# EAGLE design dual_encoder_shield_revC (EAGLE 8.6.0)
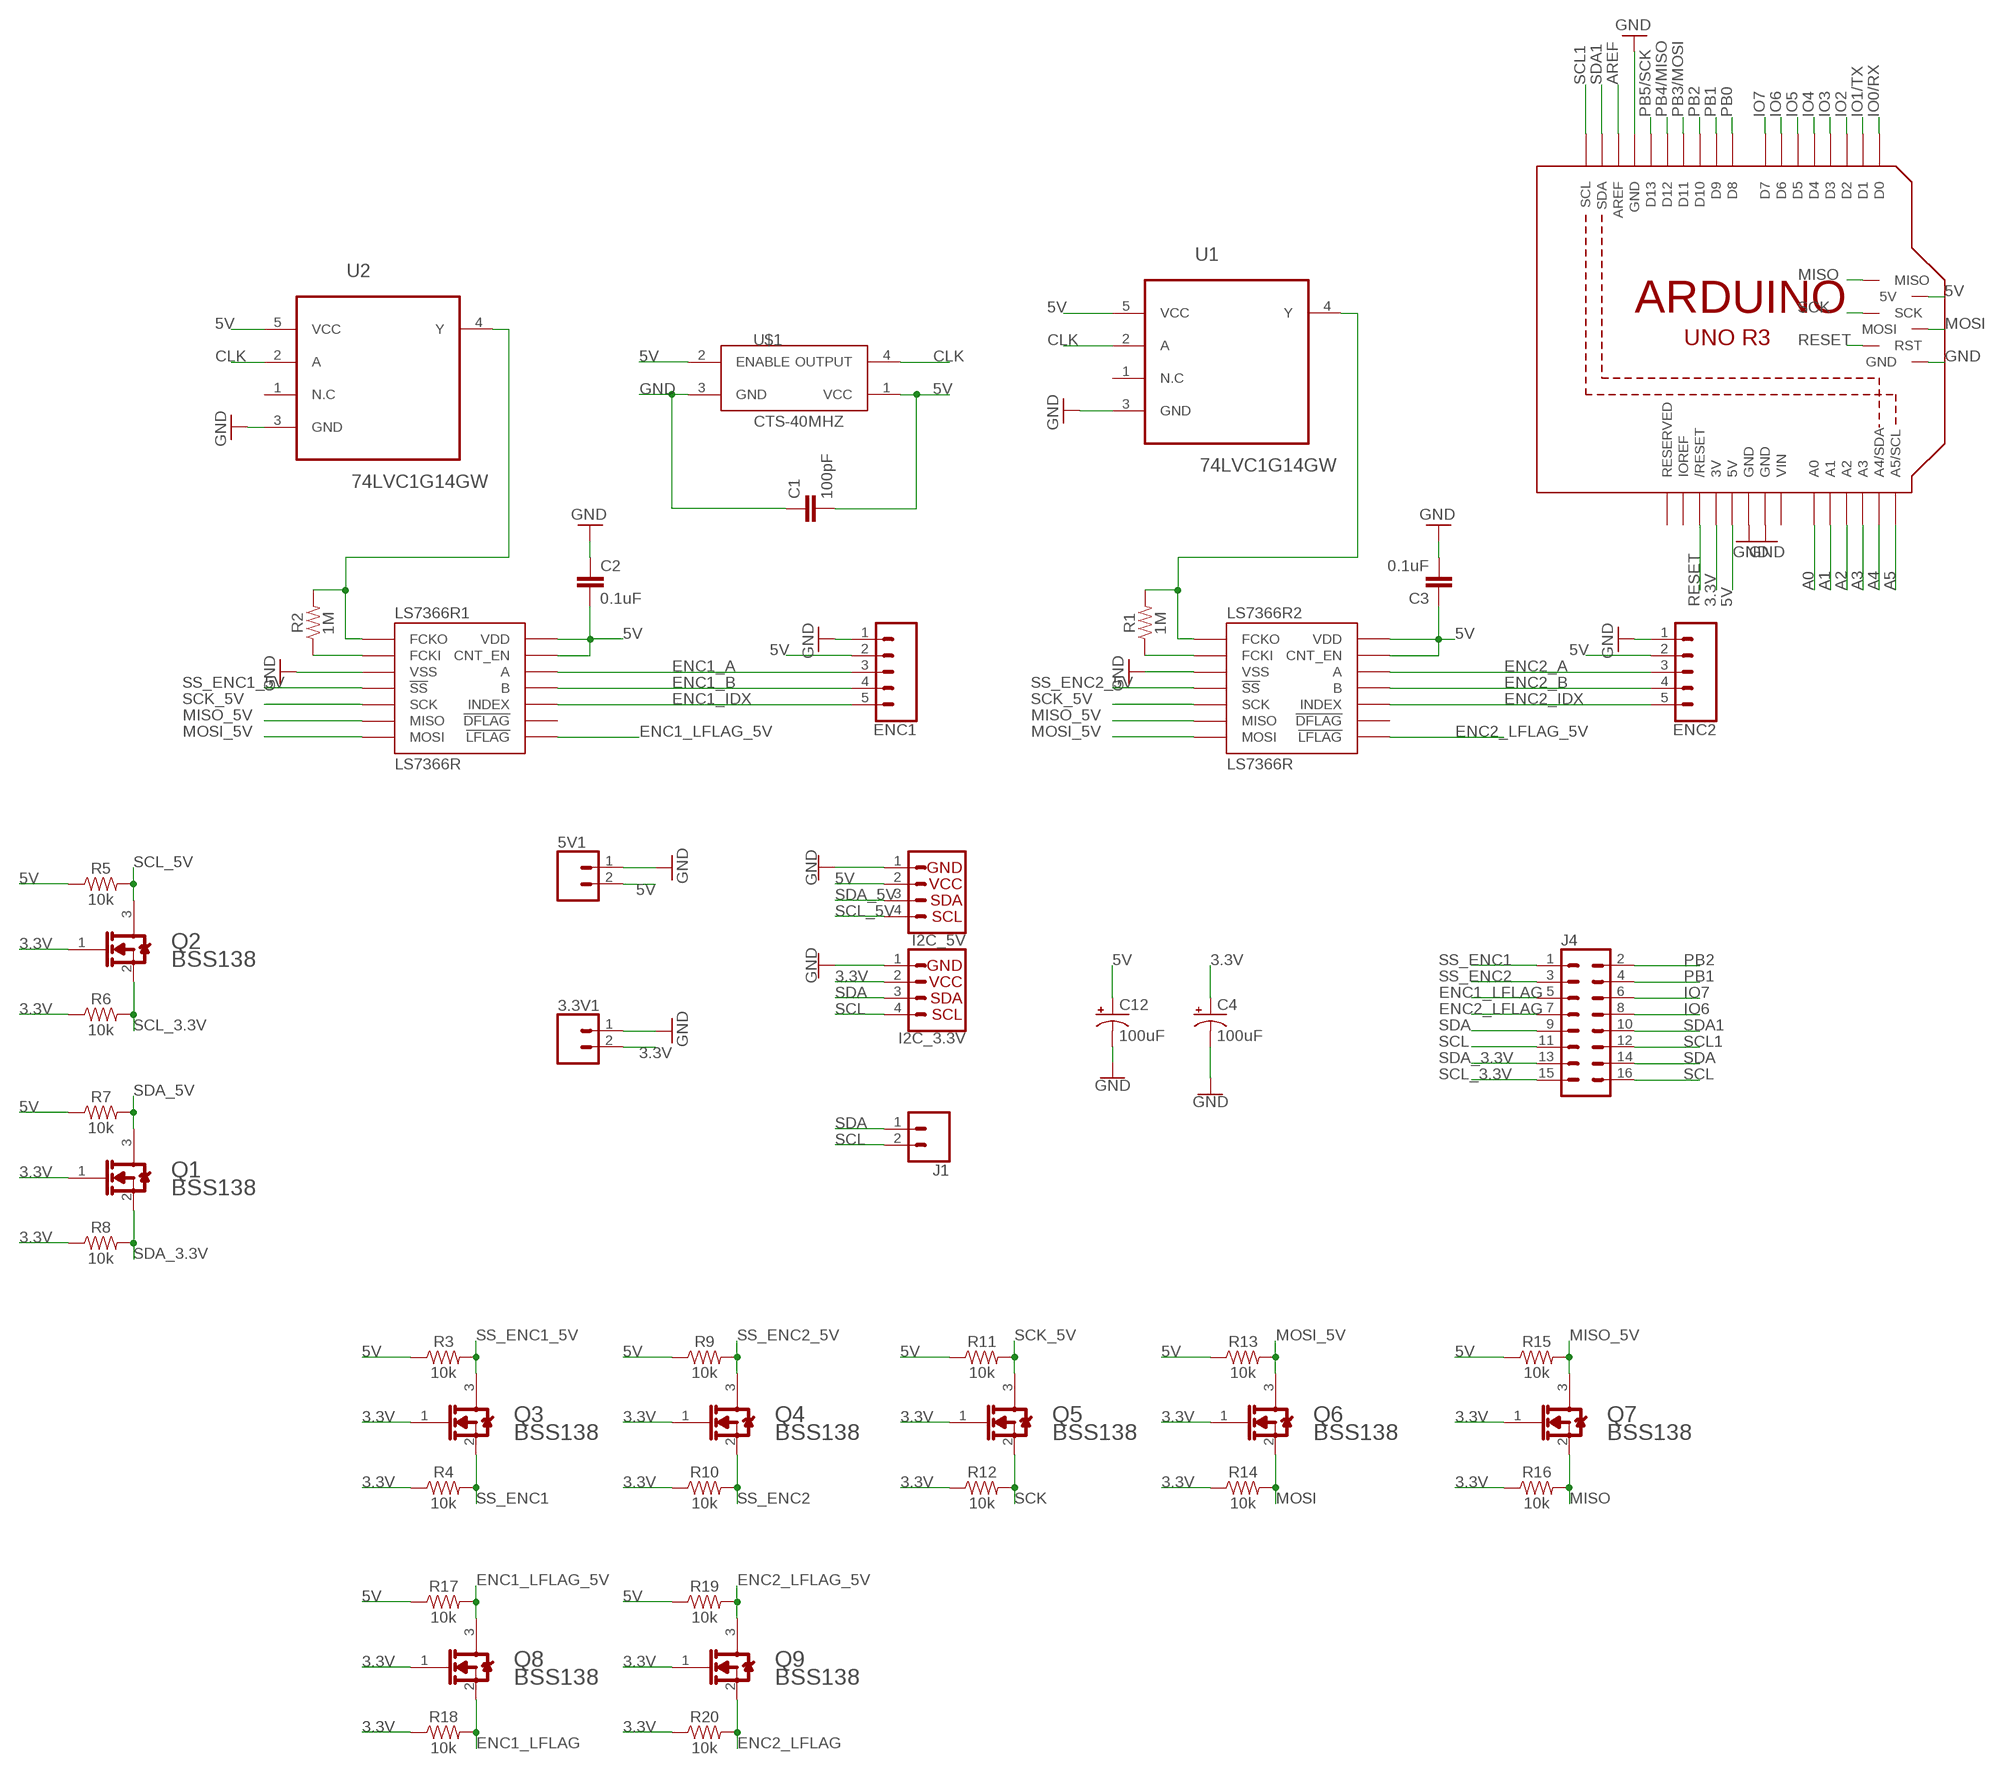
[diagram p0: schematic, sheet 1]

## Parts
3.3V1  CONN_02-JST-2MM-SMT  [JST-2-SMD]
5V1  CONN_02-JST-2MM-SMT  [JST-2-SMD]
C1  100pF  100PF-0603-50V-5%  [0603]
C2  0.1uF  0.1UF-0603-25V-5%  [0603]
C3  0.1uF  0.1UF-0603-25V-5%  [0603]
C4  100uF  100UF-POLAR-25V-20%(ELEC)  [PANASONIC_D]
C12  100uF  100UF-POLAR-25V-20%(ELEC)  [PANASONIC_D]
ENC1  CONN_05  [1X05]
ENC2  CONN_05  [1X05]
I2C_3.3V  QWIIC_CONNECTORJS-1MM  [JST04_1MM_RA]
I2C_5V  QWIIC_CONNECTORJS-1MM  [JST04_1MM_RA]
J1  CONN_02  [1X02]
J4  CONN_08X2  [2X8]
LS7366R1  LS7366R  [SOIC14]
LS7366R2  LS7366R  [SOIC14]
M1  ARDUINO_R3_ICSP  [ARDUINOR3_ICSP]
Q1  ON_SEMI_BSS138ON_SEMI_BSS138_0_0  [ON_SEMI_BSS138_0]
Q2  ON_SEMI_BSS138ON_SEMI_BSS138_0_0  [ON_SEMI_BSS138_0]
Q3  ON_SEMI_BSS138ON_SEMI_BSS138_0_0  [ON_SEMI_BSS138_0]
Q4  ON_SEMI_BSS138ON_SEMI_BSS138_0_0  [ON_SEMI_BSS138_0]
Q5  ON_SEMI_BSS138ON_SEMI_BSS138_0_0  [ON_SEMI_BSS138_0]
Q6  ON_SEMI_BSS138ON_SEMI_BSS138_0_0  [ON_SEMI_BSS138_0]
Q7  ON_SEMI_BSS138ON_SEMI_BSS138_0_0  [ON_SEMI_BSS138_0]
Q8  ON_SEMI_BSS138ON_SEMI_BSS138_0_0  [ON_SEMI_BSS138_0]
Q9  ON_SEMI_BSS138ON_SEMI_BSS138_0_0  [ON_SEMI_BSS138_0]
R1  1M  1MOHM-0603-1/4W-5%  [0603]
R2  1M  1MOHM-0603-1/4W-5%  [0603]
R3  10k  10KOHM-0603-1/10W-1%  [0603]
R4  10k  10KOHM-0603-1/10W-1%  [0603]
R5  10k  10KOHM-0603-1/10W-1%  [0603]
R6  10k  10KOHM-0603-1/10W-1%  [0603]
R7  10k  10KOHM-0603-1/10W-1%  [0603]
R8  10k  10KOHM-0603-1/10W-1%  [0603]
R9  10k  10KOHM-0603-1/10W-1%  [0603]
R10  10k  10KOHM-0603-1/10W-1%  [0603]
R11  10k  10KOHM-0603-1/10W-1%  [0603]
R12  10k  10KOHM-0603-1/10W-1%  [0603]
R13  10k  10KOHM-0603-1/10W-1%  [0603]
R14  10k  10KOHM-0603-1/10W-1%  [0603]
R15  10k  10KOHM-0603-1/10W-1%  [0603]
R16  10k  10KOHM-0603-1/10W-1%  [0603]
R17  10k  10KOHM-0603-1/10W-1%  [0603]
R18  10k  10KOHM-0603-1/10W-1%  [0603]
R19  10k  10KOHM-0603-1/10W-1%  [0603]
R20  10k  10KOHM-0603-1/10W-1%  [0603]
U1  74LVC1G14GW  [SOT65P210X110-5N]
U2  74LVC1G14GW  [SOT65P210X110-5N]
U$1  CTS-40MHZ  [SOIC254P1016X440-4N]

## Nets
3.3V: 3.3V1.2 C4.+ I2C_3.3V.2 M1.3V Q1.1(G) Q2.1(G) Q3.1(G) Q4.1(G) Q5.1(G) Q6.1(G) Q7.1(G) Q8.1(G) Q9.1(G) R4.1 R6.1 R8.1 R10.1 R12.1 R14.1 R16.1 R18.1 R20.1
5V: 5V1.2 C1.2 C2.2 C3.1 C12.+ ENC1.2 ENC2.2 I2C_5V.2 LS7366R1.13(CNT_EN) LS7366R1.14(VDD) LS7366R2.13(CNT_EN) LS7366R2.14(VDD) M1.5V M1.5V_ICSP(5V) R3.1 R5.1 R7.1 R9.1 R11.1 R13.1 R15.1 R17.1 R19.1 U1.5(VCC) U2.5(VCC) U$1.1(VCC) U$1.2(ENABLE)
A0: M1.A0
A1: M1.A1
A2: M1.A2
A3: M1.A3
A4: M1.A4(A4/SDA)
A5: M1.A5(A5/SCL)
AREF: M1.AREF
CLK: U1.2(A) U2.2(A) U$1.4(OUTPUT)
ENC1_A: ENC1.3 LS7366R1.12(A)
ENC1_B: ENC1.4 LS7366R1.11(B)
ENC1_IDX: ENC1.5 LS7366R1.10(INDEX)
ENC1_LFLAG: J4.5 Q8.2(S) R18.2
ENC1_LFLAG_5V: LS7366R1.8(!LFLAG) Q8.3(D) R17.2
ENC2_A: ENC2.3 LS7366R2.12(A)
ENC2_B: ENC2.4 LS7366R2.11(B)
ENC2_IDX: ENC2.5 LS7366R2.10(INDEX)
ENC2_LFLAG: J4.7 Q9.2(S) R20.2
ENC2_LFLAG_5V: LS7366R2.8(!LFLAG) Q9.3(D) R19.2
GND: 3.3V1.1 5V1.1 C1.1 C2.1 C3.2 C4.- C12.- ENC1.1 ENC2.1 I2C_3.3V.1 I2C_5V.1 LS7366R1.3(VSS) LS7366R2.3(VSS) M1.GND M1.GND@1(GND) M1.GND@2(GND) M1.GND@3(GND) U1.3(GND) U2.3(GND) U$1.3(GND)
IO0/RX: M1.D0
IO1/TX: M1.D1
IO2: M1.D2
IO3: M1.D3
IO4: M1.D4
IO5: M1.D5
IO6: J4.8 M1.D6
IO7: J4.6 M1.D7
MISO: M1.MISO Q7.2(S) R16.2
MISO_5V: LS7366R1.6(MISO) LS7366R2.6(MISO) Q7.3(D) R15.2
MOSI: M1.MOSI Q6.2(S) R14.2
MOSI_5V: LS7366R1.7(MOSI) LS7366R2.7(MOSI) Q6.3(D) R13.2
N$6: LS7366R1.2(FCKI) R2.1
N$8: LS7366R2.1(FCKO) R1.2 U1.4(Y)
N$9: LS7366R2.2(FCKI) R1.1
N$10: LS7366R1.1(FCKO) R2.2 U2.4(Y)
PB0: M1.D8
PB1: J4.4 M1.D9
PB2: J4.2 M1.D10
PB3/MOSI: M1.D11
PB4/MISO: M1.D12
PB5/SCK: M1.D13
RESET: M1.RESET(/RESET) M1.RESET_ICSP(RST)
SCK: M1.SCK Q5.2(S) R12.2
SCK_5V: LS7366R1.5(SCK) LS7366R2.5(SCK) Q5.3(D) R11.2
SCL: I2C_3.3V.4 J1.2 J4.11 J4.16
SCL1: J4.12 M1.SCL
SCL_3.3V: J4.15 Q2.2(S) R6.2
SCL_5V: I2C_5V.4 Q2.3(D) R5.2
SDA: I2C_3.3V.3 J1.1 J4.9 J4.14
SDA1: J4.10 M1.SDA
SDA_3.3V: J4.13 Q1.2(S) R8.2
SDA_5V: I2C_5V.3 Q1.3(D) R7.2
SS_ENC1: J4.1 Q3.2(S) R4.2
SS_ENC1_5V: LS7366R1.4(!SS) Q3.3(D) R3.2
SS_ENC2: J4.3 Q4.2(S) R10.2
SS_ENC2_5V: LS7366R2.4(!SS) Q4.3(D) R9.2
Unconnected: LS7366R1.9(!DFLAG) LS7366R2.9(!DFLAG) M1.IOREF M1.RESERVED U1.1(N.C) U2.1(N.C)

## Power pins joined to a net without a drawn wire
VIN: M1.VIN

## Library data of the parts
3.3V1 5V1 = SparkFun-Connectors:CONN_02: Multi connection point. Often used as Generic Header-pin footprint for 0.1 inch spaced/style header connections On any of the 0.1 inch spaced packages, you can populate with these: Break Away Headers - Straight <https://www.sparkfun.com/products/116> (PRT-00116) Break Away Male Headers - Right Angle <https://www.sparkfun.com/products/553> (PRT-00553) Female Headers <https://www.sparkfun.com/products/115> (PRT-00115) Break Away Headers - Machine Pin <https://www.sparkfun.com/products/117> (PRT-00117) Break Away Female Headers - Swiss Machine Pin <https://www.sparkfun.com/products/743> (PRT-00743) For SCREWTERMINALS and SPRING TERMINALS visit here: Screw Terimnals on SparkFun.com <https://www.sparkfun.com/search/results?term=Screw+Terminals> (5mm/3.5mm/2.54mm spacing) This device is also useful as a general connection point to wire up your design to another part of your project. Our various solder wires solder well into these plated through hole pads. Hook-Up Wire - Assortment (Stranded, 22 AWG) <https://www.sparkfun.com/products/11375> (PRT-11375) Hook-Up Wire - Assortment (Solid Core, 22 AWG) <https://www.sparkfun.com/products/11367> (PRT-11367) View the entire wire category on our website here <https://www.sparkfun.com/categories/141> Special notes: Molex polarized connector foot print use with: PRT-08233 with associated crimp pins and housings. 2.54_SCREWTERM for use with PRT-10571. 3.5mm Screw Terminal footprints for PRT-08084 5mm Screw Terminal footprints for use with PRT-08432; PROD_ID: CONN-11443
C1 = SparkFun-Capacitors:100PF: 100pF/0.1nF ceramic capacitors A capacitor is a passive two-terminal electrical component used to store electrical energy temporarily in an electric field.; PROD_ID: CAP-07883
C2 C3 = SparkFun-Capacitors:0.1UF: 0.1µF ceramic capacitors A capacitor is a passive two-terminal electrical component used to store electrical energy temporarily in an electric field.; PROD_ID: CAP-08604
C4 C12 = SparkFun-Capacitors:100UF-POLAR: 100µF polarized capacitors A capacitor is a passive two-terminal electrical component used to store electrical energy temporarily in an electric field.; PROD_ID: CAP-12547
ENC1 ENC2 = SparkFun-Connectors:CONN_05: Multi connection point. Often used as Generic Header-pin footprint for 0.1 inch spaced/style header connections On any of the 0.1 inch spaced packages, you can populate with these: Break Away Headers - Straight <https://www.sparkfun.com/products/116> (PRT-00116) Break Away Male Headers - Right Angle <https://www.sparkfun.com/products/553> (PRT-00553) Female Headers <https://www.sparkfun.com/products/115> (PRT-00115) Break Away Headers - Machine Pin <https://www.sparkfun.com/products/117> (PRT-00117) Break Away Female Headers - Swiss Machine Pin <https://www.sparkfun.com/products/743> (PRT-00743) For SCREWTERMINALS and SPRING TERMINALS visit here: Screw Terimnals on SparkFun.com <https://www.sparkfun.com/search/results?term=Screw+Terminals> (5mm/3.5mm/2.54mm spacing) This device is also useful as a general connection point to wire up your design to another part of your project. Our various solder wires solder well into these plated through hole pads. Hook-Up Wire - Assortment (Stranded, 22 AWG) <https://www.sparkfun.com/products/11375> (PRT-11375) Hook-Up Wire - Assortment (Solid Core, 22 AWG) <https://www.sparkfun.com/products/11367> (PRT-11367) View the entire wire category on our website here <https://www.sparkfun.com/categories/141> Special notes: Molex polarized connector foot print use with SKU : PRT-08231 with associated crimp pins and housings. 1MM SMD Version SKU: PRT-10208
I2C_3.3V I2C_5V = SparkFun-Connectors:QWIIC_CONNECTOR: SparkFun I2C Standard Qwiic Connector An SMD 1mm pitch JST connector makes it easy and quick (get it? Qwiic?) to connect I2C devices to each other. The Qwiic system <http://www.sparkfun.com/qwiic> enables fast and solderless connection between popular platforms and various sensors and actuators. We carry 200mm <https://www.sparkfun.com/products/14204>, 100mm <https://www.sparkfun.com/products/14205>, 50mm <https://www.sparkfun.com/products/14206>, and breadboard friendly <https://www.sparkfun.com/products/14207> Qwiic cables. We also offer 10 pcs strips <https://www.sparkfun.com/products/14323> the SMD connectors.; PROD_ID: CONN-13694
J1 = SparkFun-Connectors:CONN_02: Multi connection point. Often used as Generic Header-pin footprint for 0.1 inch spaced/style header connections On any of the 0.1 inch spaced packages, you can populate with these: Break Away Headers - Straight <https://www.sparkfun.com/products/116> (PRT-00116) Break Away Male Headers - Right Angle <https://www.sparkfun.com/products/553> (PRT-00553) Female Headers <https://www.sparkfun.com/products/115> (PRT-00115) Break Away Headers - Machine Pin <https://www.sparkfun.com/products/117> (PRT-00117) Break Away Female Headers - Swiss Machine Pin <https://www.sparkfun.com/products/743> (PRT-00743) For SCREWTERMINALS and SPRING TERMINALS visit here: Screw Terimnals on SparkFun.com <https://www.sparkfun.com/search/results?term=Screw+Terminals> (5mm/3.5mm/2.54mm spacing) This device is also useful as a general connection point to wire up your design to another part of your project. Our various solder wires solder well into these plated through hole pads. Hook-Up Wire - Assortment (Stranded, 22 AWG) <https://www.sparkfun.com/products/11375> (PRT-11375) Hook-Up Wire - Assortment (Solid Core, 22 AWG) <https://www.sparkfun.com/products/11367> (PRT-11367) View the entire wire category on our website here <https://www.sparkfun.com/categories/141> Special notes: Molex polarized connector foot print use with: PRT-08233 with associated crimp pins and housings. 2.54_SCREWTERM for use with PRT-10571. 3.5mm Screw Terminal footprints for PRT-08084 5mm Screw Terminal footprints for use with PRT-08432
J4 = SparkFun-Connectors:CONN_08X2: Multi connection point. Often used as Generic Header-pin footprint for 0.1 inch spaced/style header connections You can populate with any combo of single row headers, but if you'd like an exact match, check this: Header - 2x8 (Male, 0.1") <https://www.sparkfun.com/products/13156> (PRT-13156) On any of the 0.1 inch spaced packages, you can populate with these: Break Away Headers - Straight <https://www.sparkfun.com/products/116> (PRT-00116) Break Away Male Headers - Right Angle <https://www.sparkfun.com/products/553> (PRT-00553) Female Headers <https://www.sparkfun.com/products/115> (PRT-00115) Break Away Headers - Machine Pin <https://www.sparkfun.com/products/117> (PRT-00117) Break Away Female Headers - Swiss Machine Pin <https://www.sparkfun.com/products/743> (PRT-00743)
LS7366R1 LS7366R2 = LS7366R:LS7366R; AVAILABILITY: Unavailable; MF: LSI; MP: LS7366R; PACKAGE: None; PRICE: None
M1 = adafruit:ARDUINO_R3_ICSP
Q1-Q9 = ON Semi - BSS138:ON_SEMI_BSS138: N-Channel Logic Level Enhancement Mode Field Effect Transistor; CENTROID_NOT_SPECIFIED: No; DATASHEET: https://www.fairchildsemi.com/datasheets/BS/BSS138.pdf; DIGIKEY_DESCRIPTION: TRANS MOSFET N-CH 50V 220MA SOT-23; DIGIKEY_PART_NUMBER: BSS138CT-ND; LEAD_FREE: yes; MF: ON Semi; MFG_PACKAGE_IDENT: BSS138; MFG_PACKAGE_IDENT_DATE: 0; MFG_PACKAGE_IDENT_REV: 0; MOUSER_DESCRIPTION: MOSFET SOT-23 N-CH LOGIC; MOUSER_PART_NUMBER: 512-BSS138; MPN: BSS138; PACKAGE: SOT23; PREFIX: Q; ROHS: yes; TEMPERATURE_RANGE_HIGH: +150°C; TEMPERATURE_RANGE_LOW: -55°C
R1 R2 = SparkFun-Resistors:1MOHM: 1MΩ resistor A resistor is a passive two-terminal electrical component that implements electrical resistance as a circuit element. Resistors act to reduce current flow, and, at the same time, act to lower voltage levels within circuits. - Wikipedia; PROD_ID: RES-07868
R3-R20 = SparkFun-Resistors:10KOHM: 10kΩ resistor A resistor is a passive two-terminal electrical component that implements electrical resistance as a circuit element. Resistors act to reduce current flow, and, at the same time, act to lower voltage levels within circuits. - Wikipedia; PROD_ID: RES-00824
U1 U2 = 74LVC1G14GW:74LVC1G14GW: Single Schmitt-trigger inverter; AVAILABILITY: Unavailable; DESCRIPTION: IC MOS 74LVC1G14/SO/74LVC1G14GW PHILIPS RoHS LVC SOt23; MF: NXP Semiconductors; MP: 74LVC1G14GW; PACKAGE: TSSOP-5 NXP Semiconductors; PRICE: 214.47 USD
U$1 = steveo:CTS-40MHZ

## Board
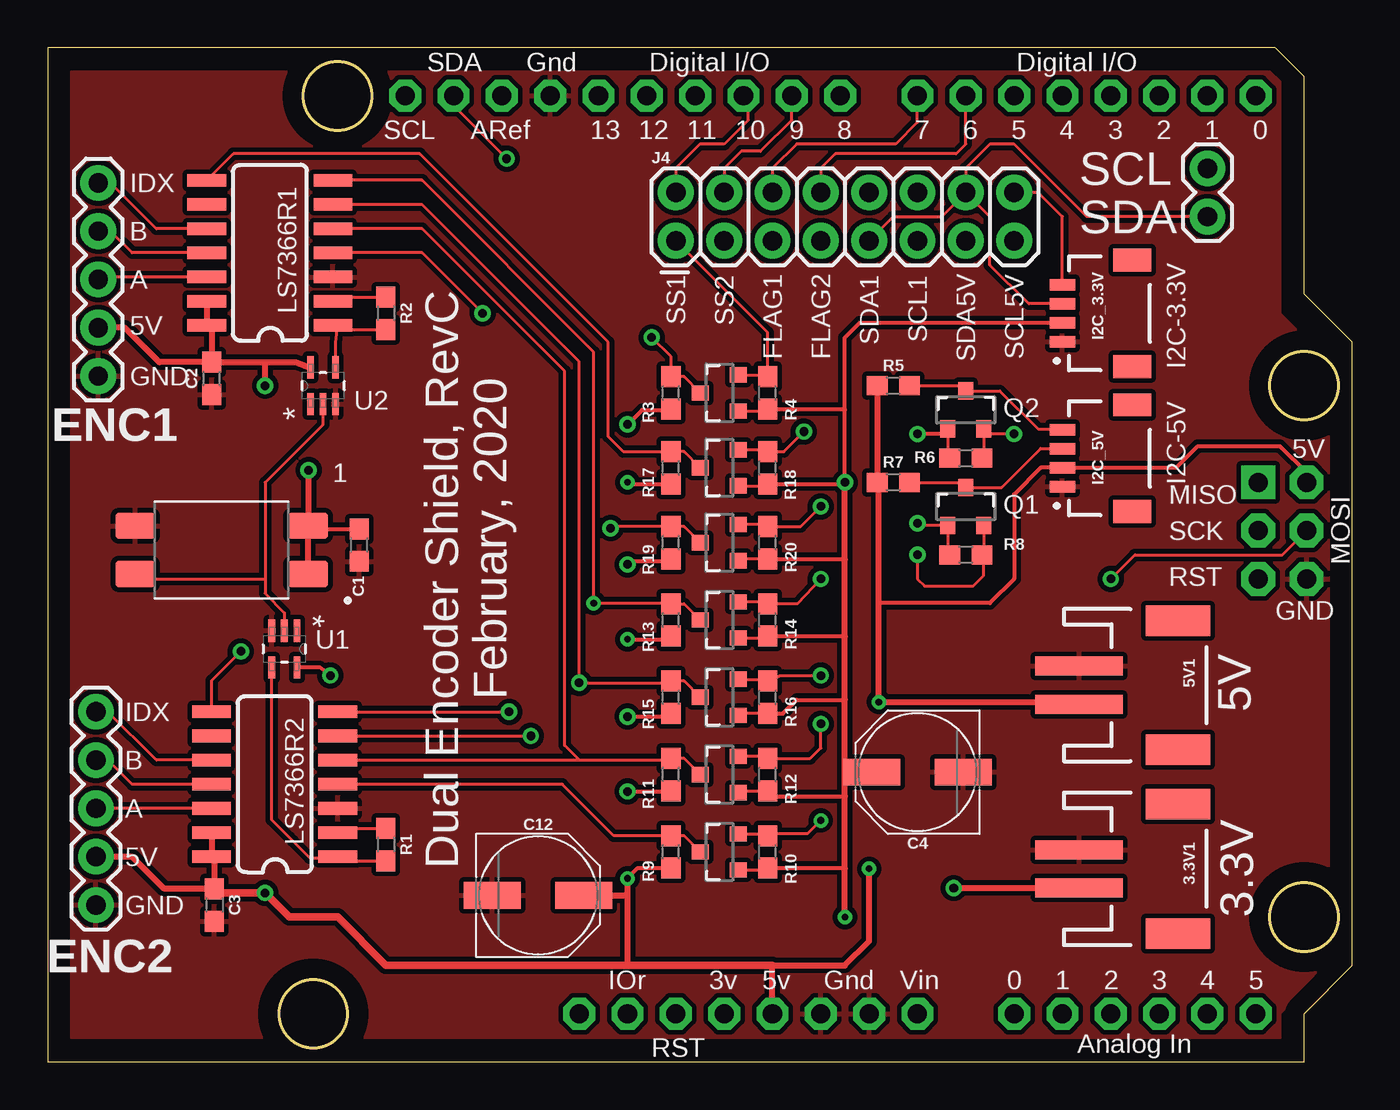
[diagram p1: board, top side]
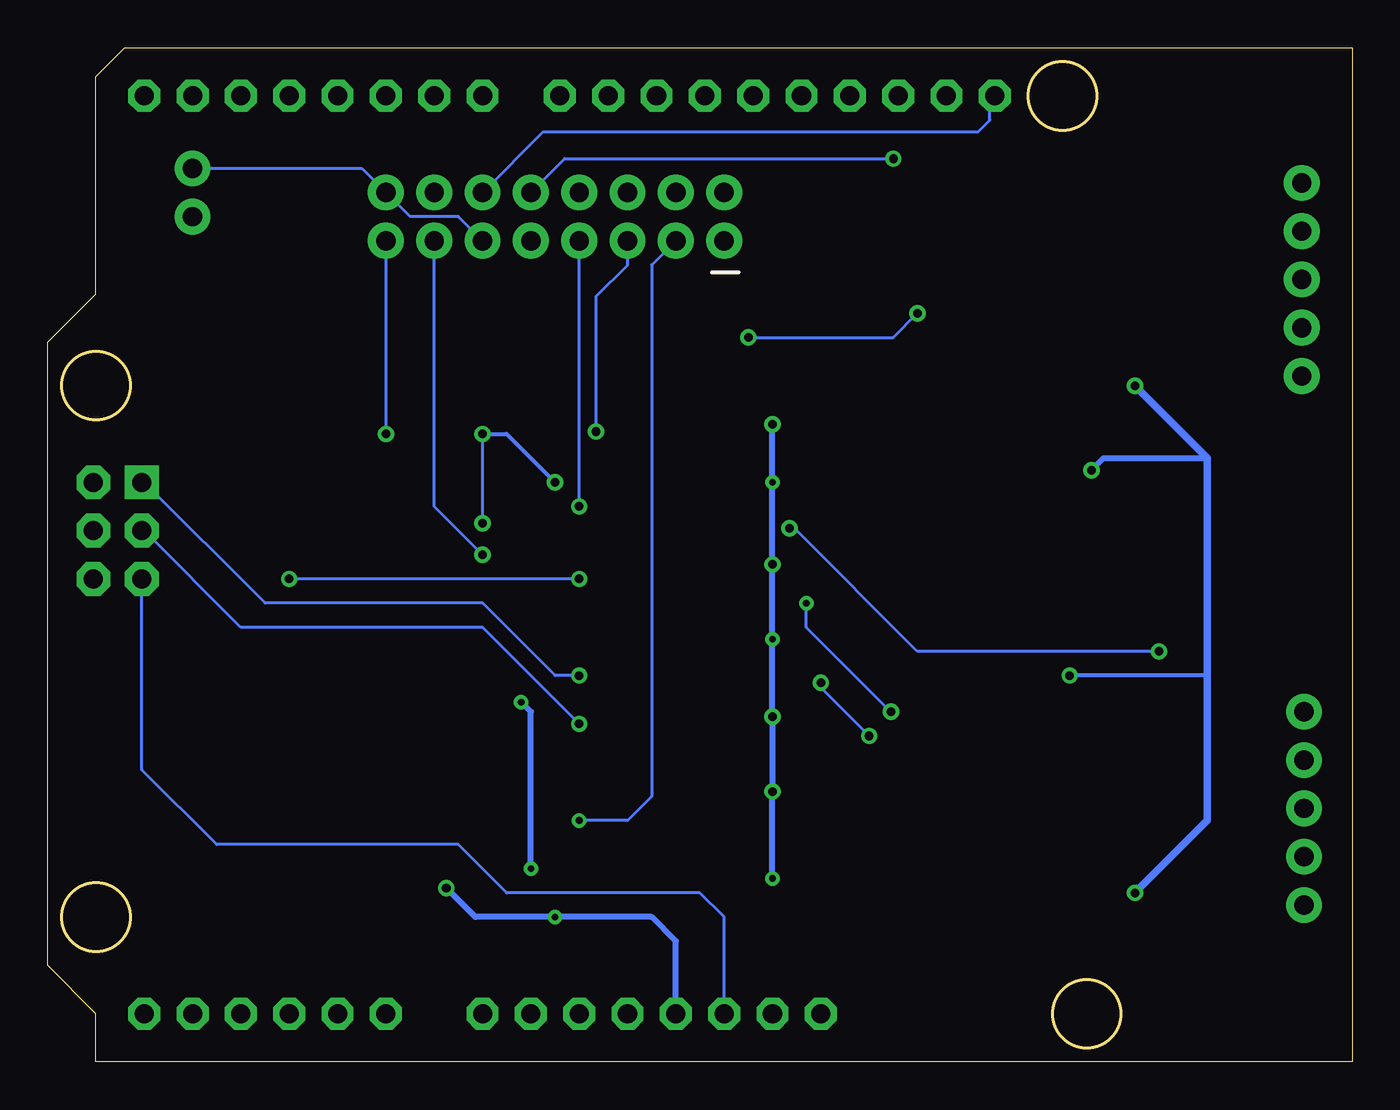
[diagram p2: board, bottom side, seen from below]

Size 68.58 x 53.34 mm. Coordinates in mm from the lower left corner, seen from the top.
Outline: circle at 15.24,50.8 radius 1.8
Outline: circle at 66.04,35.56 radius 1.8
Outline: circle at 13.97,2.54 radius 1.8
Outline: circle at 66.04,7.62 radius 1.8
Copper layers (1*16): Top 0.035mm / dielectric 1.5mm / Bottom 0.035mm
Design rules "default": minimum track width 6mil, minimum drill 0.35mm, track to track 6mil, track to pad 6mil, pad to pad 6mil, via to via 6mil, smd to smd 6mil, copper to edge 40mil, drill to drill 6mil, minimum pad ring 10mil, minimum via ring 8mil, stop-mask expansion 4mil, vias tented up to drill 0mil, thermal gap 10mil

### Footprints (pad centres in the part's own frame; a part is rotated, then mirrored left to right if it is on the bottom)
JST-2-SMD = smd 1 x 4.6: 1 -1,-3.7; 2 1,-3.7 | smd 1.6 x 3.4: NC1 -3.4,1.5; NC2 3.4,1.5
0603 = smd 1.1 x 1: 1 -0.85,0; 2 0.85,0
PANASONIC_D = smd 3 x 1.4: + 2.4,0; - -2.4,0
1X05 = drill 1.016 pad 1.88: 1 0,0; 2 2.54,0; 3 5.08,0; 4 7.62,0; 5 10.16,0
JST04_1MM_RA = smd 0.6 x 1.35: 1 -1.5,0; 2 -0.5,0; 3 0.5,0; 4 1.5,0 | smd 1.2 x 2: NC1 2.8,-3.675; NC2 -2.8,-3.675
1X02 = drill 1.016 pad 1.88: 1 0,0; 2 2.54,0
2X8 = drill 1.016 pad 1.88: 1 0,0; 2 0,2.54; 3 2.54,0; 4 2.54,2.54; 5 5.08,0; 6 5.08,2.54; 7 7.62,0; 8 7.62,2.54; 9 10.16,0; 10 10.16,2.54; 11 12.7,0; 12 12.7,2.54; 13 15.24,0; 14 15.24,2.54; 15 17.78,0; 16 17.78,2.54
SOIC14 = smd 2.032 x 0.66: 1 -3.315,4.445; 2 -3.315,3.175; 3 -3.315,1.905; 4 -3.315,0.635; 5 -3.315,-0.635; 6 -3.315,-1.905; 7 -3.315,-3.175; 8 3.315,-3.175; 9 3.315,-1.905; 10 3.315,-0.635; 11 3.315,0.635; 12 3.315,1.905; 13 3.315,3.175; 14 3.315,4.445
ARDUINOR3_ICSP = drill 1 pad 1.676 octagon: 3V 35.56,2.54; 5V 38.1,2.54; A0 50.8,2.54; A1 53.34,2.54; A2 55.88,2.54; A3 58.42,2.54; A4 60.96,2.54; A5 63.5,2.54; AREF 23.876,50.8; D0 63.5,50.8; D1 60.96,50.8; D2 58.42,50.8; D3 55.88,50.8; D4 53.34,50.8; D5 50.8,50.8; D6 48.26,50.8; D7 45.72,50.8; D8 41.656,50.8; D9 39.116,50.8; D10 36.576,50.8; D11 34.036,50.8; D12 31.496,50.8; D13 28.956,50.8; GND 26.416,50.8; GND@1 43.18,2.54; GND@2 40.64,2.54; IOREF 30.48,2.54; RESERVED 27.94,2.54; RESET 33.02,2.54; SCL 18.796,50.8; SDA 21.336,50.8; VIN 45.72,2.54 | drill 1 pad 1.778 octagon: 5V_ICSP 66.167,30.48; GND@3 66.167,25.4; MOSI 66.167,27.94; RESET_ICSP 63.627,25.4; SCK 63.627,27.94 | drill 1 pad 1.778 square: MISO 63.627,30.48
ON_SEMI_BSS138_0 = smd 0.8 x 0.9: 1 -0.95,-1; 2 0.95,-1; 3 0,1
SOT65P210X110-5N = smd 1.168 x 0.356: 1 -0.965,0.66; 2 -0.965,0; 3 -0.965,-0.66; 4 0.965,-0.66; 5 0.965,0.66
SOIC254P1016X440-4N = smd 2.09 x 1.39: 1 -4.54,1.27; 2 -4.54,-1.27; 3 4.54,-1.27; 4 4.54,1.27

### Placement (x,y rotation side)
3.3V1  57.91,10.16 270 top
5V1  57.91,19.81 270 top
C1  16.38,27.18 90 top
C2  8.64,35.94 90 top
C3  8.76,8.26 270 top
C4  45.72,15.24 180 top
C12  25.78,8.76 0 top
ENC1  2.67,36.07 90 top
ENC2  2.54,8.26 90 top
I2C_3.3V  53.34,39.37 90 top
I2C_5V  53.34,31.75 90 top
J1  60.96,44.45 90 top
J4  33.02,43.18 0 top
LS7366R1  11.68,43.18 180 top
LS7366R2  11.94,15.24 180 top
M1  0,0 0 top
Q1  48.26,29.21 0 top
Q2  48.26,34.29 0 top
Q3  35.31,35.18 90 top
Q4  35.31,11.05 90 top
Q5  35.31,15.11 90 top
Q6  35.31,23.24 90 top
Q7  35.31,19.18 90 top
Q8  35.31,31.24 90 top
Q9  35.31,27.3 90 top
R1  17.78,11.43 270 top
R2  17.78,39.37 270 top
R3  32.77,35.18 90 top
R4  37.85,35.18 90 top
R5  44.45,35.56 0 top
R6  48.26,31.75 0 top
R7  44.45,30.48 0 top
R8  48.26,26.67 0 top
R9  32.77,11.05 90 top
R10  37.85,11.05 90 top
R11  32.77,15.11 90 top
R12  37.85,15.11 90 top
R13  32.77,23.24 90 top
R14  37.85,23.24 90 top
R15  32.77,19.18 90 top
R16  37.85,19.18 90 top
R17  32.77,31.24 90 top
R18  37.85,31.24 90 top
R19  32.77,27.3 90 top
R20  37.85,27.3 90 top
U1  12.45,21.72 270 top
U2  14.48,35.56 90 top
U$1  9.14,26.92 180 top

### Tracks (layer width: path | path; a pad name or v marks a point on that pad's centre or on a via)
3.3V  (via drill 0.35, 0.45)
  Top 0.152: Q2.1 47.31,31.85 R6.1 | R8.1 47.31,26.77 Q1.1 45.83,28.21 v45.72,28.32 | Q9.1 36.41,26.45 R20.1 37.88,26.42 | R16.1 36.41,18.33 Q7.1 | Q5.1 36.41,14.26 R12.1 | Q8.1 37.75,30.29 R18.1 37.93,30.48 | Q3.1 37.75,34.23 R4.1 | Q6.1 37.75,22.29 R14.1 38.27,21.97 | Q4.1 37.75,10.1 R10.1
  Top 0.203: Q2.1 47.04,33.02 v45.72,33.02 | 37.81,10.03 37.75,10.1 | 41.91,34.29 v41.91,30.48 41.82,30.39 R18.1 | 41.91,34.29 41.91,38.1 42.68,38.87 I2C_3.3V.2 | 41.91,10.16 41.87,10.2 R10.1 | R12.1 38.14,13.97 41.91,13.97 | R16.1 38.65,18.33 39.37,19.05 41.91,19.05 | R14.1 41.87,22.39 41.91,22.35 | R20.1 41.87,26.45 41.91,26.42 | R4.1 41.87,34.33 41.91,34.29
  Top 0.305: v41.91,7.62 41.91,10.16 41.91,13.97 41.91,15.24 | 41.91,15.24 41.91,19.05 41.91,22.35 41.91,26.42 v41.91,30.48 | v47.62,9.14 52.16,9.14 | C4.+ 41.91,15.24
  Top 0.61: 52.16,9.14 3.3V1.2
  Bottom 0.152: v45.72,28.32 v45.72,33.02
  Bottom 0.203: v45.72,33.02 44.45,33.02 v41.91,30.48
  Bottom 0.305: M1.3V 35.56,6.35 36.83,7.62 v41.91,7.62 46.1,7.62 v47.62,9.14
5V  (via drill 0.35, 0.45)
  Top 0.203: M1.5V_ICSP 66.17,30.99 64.77,32.38 60.45,32.38 59.32,31.25 I2C_5V.2 52.2,31.25 50.8,29.84 50.8,25.4 49.53,24.13 43.69,24.13 | 32.77,33.91 R3.1 32.73,34.29 31.24,34.29 v30.48,33.53 | 32.65,26.34 32.68,26.37 | 32.68,26.37 R19.1 | 32.77,26.29 32.7,26.35 | 32.7,26.35 32.68,26.37 | v14.86,20.32 14.3,20.75 U1.5 | v30.48,26.16 30.54,26.35 32.7,26.35 | v30.48,30.48 30.57,30.39 R17.1 | v30.48,18.16 32.6,18.16 R15.1 | v30.48,14.22 32.73,14.22 R11.1 | v30.48,9.65 31.03,10.2 R9.1 | v30.48,22.23 32.6,22.23 R13.1 | U$1.2 13.85,28.03 C1.2
  Top 0.305: LS7366R1.13 LS7366R1.14 8.64,38.47 C2.2 | C2.2 5.88,36.79 4.06,38.61 ENC1.2 | LS7366R2.13 LS7366R2.14 8.76,10.65 C3.1 6.13,9.11 4.45,10.79 ENC2.2 | C2.2 11.43,36.79 | 11.43,36.79 13.04,36.79 U2.5 | v11.43,35.56 11.43,36.79 | U$1.1 U$1.2 13.72,28.23 v13.72,31.11 | 30.48,5.08 30.48,8.89 | 30.48,8.89 v30.48,9.65 | M1.5V 38.1,5.08 41.91,5.08 43.18,6.35 v43.18,10.16 | R5.1 R7.1 43.56,30.44 43.69,30.31 43.69,24.13 v43.69,18.92 | 43.56,19.05 v43.69,18.92 | C12.+ 30.35,8.76 30.48,8.89 | v43.69,18.92 54.1,18.92 5V1.2
  Top 0.406: C3.1 8.98,8.89 v11.43,8.89 12.7,7.62 15.24,7.62 17.78,5.08 30.48,5.08 38.1,5.08
  Bottom 0.203: 7.62,20.32 v14.86,20.32
  Bottom 0.305: v30.48,33.53 v30.48,30.48 v30.48,26.16 v30.48,22.23 v30.48,18.16 v30.48,14.22 v30.48,9.65 | v13.72,31.11 13.08,31.75 7.62,31.75 | v43.69,18.92 43.18,18.41 v43.18,10.16
  Bottom 0.406: v11.43,8.89 7.62,12.7 7.62,20.32 7.62,31.75 v11.43,35.56
CLK
  Top 0.152: U1.2 12.45,23.62 11.43,24.64 11.43,25.4 | U2.2 14.48,33.53 11.43,30.48 11.43,25.4 | U$1.4 4.86,25.4 11.43,25.4
ENC1_A
  Top 0.152: LS7366R1.12 2.79,41.27 ENC1.3
ENC1_B
  Top 0.152: LS7366R1.11 4.45,42.55 3.3,43.69 ENC1.4
ENC1_IDX
  Top 0.152: LS7366R1.10 5.71,43.81 3.3,46.23 ENC1.5
ENC1_LFLAG  (via drill 0.45)
  Top 0.152: Q8.2 37.75,32.19 R18.2 | 38.27,32.09 R18.2 | R18.2 38.1,32.35 | R18.2 38.7,32.09 v39.75,33.15
  Bottom 0.152: v39.75,33.15 39.75,40.26 38.1,41.91 J4.5
ENC1_LFLAG_5V
  Top 0.152: Q8.3 33.46,32.09 R17.2 | LS7366R1.8 9.77,47.75 19.56,47.75 29.46,37.85 29.46,32.89 30.27,32.09 R17.2 | R17.2 32.35,32.51
ENC2_A
  Top 0.152: LS7366R2.12 ENC2.3
ENC2_B
  Top 0.152: LS7366R2.11 4.45,14.61 3.17,15.88 ENC2.4
ENC2_IDX
  Top 0.152: LS7366R2.10 5.71,15.88 3.17,18.41 ENC2.5
ENC2_LFLAG  (via drill 0.45)
  Top 0.152: Q9.2 37.75,28.25 R20.2 39.59,28.16 v40.64,29.21
  Bottom 0.152: v40.64,29.21 J4.7
ENC2_LFLAG_5V  (via drill 0.45)
  Top 0.152: Q9.3 33.46,28.16 R19.2 | LS7366R2.8 8.62,20.05 v10.16,21.59 | 32.35,28.57 R19.2 | v29.59,28.07 29.68,28.16 R19.2
  Bottom 0.152: v10.16,21.59 22.86,21.59 29.34,28.07 v29.59,28.07
GND
  pour Top (isolate 0.254): 1.27,52.07 64.77,52.07 64.77,39.37 67.31,36.83 67.31,5.08 64.77,2.54 64.77,1.27 1.27,1.27
IO6
  Top 0.152: M1.D6 48.26,48.26 47.75,47.75 41.4,47.75 40.64,46.99 J4.8
IO7
  Top 0.152: M1.D7 45.72,49.4 44.58,48.26 39.37,48.26 38.1,46.99 J4.6
MISO  (via drill 0.45)
  Top 0.152: Q7.2 37.75,20.13 R16.2 | 37.88,20.07 R16.2 | R16.2 38.52,20.32 v40.64,20.32
  Bottom 0.152: M1.MISO 63.5,30.48 57.15,24.13 45.72,24.13 41.91,20.32 v40.64,20.32
MISO_5V  (via drill 0.45)
  Top 0.152: LS7366R1.6 19.68,45.09 27.94,36.83 v27.94,19.94 32.68,19.94 R15.2 | Q7.3 33.46,20.03 R15.2 | 32.77,20.45 R15.2 | R15.2 32.73,20.07 | LS7366R2.6 v25.4,17.14
  Bottom 0.152: v25.4,17.14 27.94,19.68 v27.94,19.94
MOSI  (via drill 0.45)
  Top 0.152: v55.88,25.4 57.15,26.67 64.9,26.67 M1.MOSI | Q6.2 37.75,24.19 R14.2 39.41,24.09 v40.64,25.4
  Bottom 0.152: v40.64,25.4 v55.88,25.4
MOSI_5V  (via drill 0.35, 0.45)
  Top 0.152: LS7366R1.7 19.68,46.35 28.7,37.34 v28.7,24.13 32.98,24.13 33.02,24.09 | 33.02,24.09 R13.2 32.35,24.51 | 33.02,24.09 33.46,24.09 Q6.3 | LS7366R2.7 v24.26,18.41
  Bottom 0.152: v24.26,18.41 28.7,22.86 v28.7,24.13
N$6
  Top 0.152: LS7366R1.2 15.21,40.22 R2.1
N$8
  Top 0.152: LS7366R2.1 15.31,10.74 | 15.31,10.74 15.47,10.58 R1.2 | 15.31,10.74 13.77,10.74 12.89,11.62 12.7,11.81 11.79,12.72 U1.4
N$9
  Top 0.152: LS7366R2.2 15.47,12.28 R1.1
N$10
  Top 0.152: LS7366R1.1 15.21,38.52 | 15.21,38.52 R2.2 | U2.4 15.14,37.83 15.21,38.52
PB1
  Top 0.152: M1.D9 39.12,49.53 37.47,47.88 36.45,47.88 35.56,46.99 J4.4
PB2
  Top 0.152: M1.D10 36.83,50.55 36.83,49.53 35.56,48.26 34.29,48.26 33.02,46.99 J4.2
RESET
  Bottom 0.152: M1.RESET 33.02,7.62 34.29,8.89 44.45,8.89 46.99,11.43 59.69,11.43 63.63,15.37 M1.RESET_ICSP
SCK  (via drill 0.45)
  Top 0.152: R12.2 37.75,16.06 Q5.2 | R12.2 38.27,16.38 | R12.2 40.09,15.96 40.64,16.51 v40.64,17.78
  Bottom 0.152: M1.SCK 63.5,27.94 58.42,22.86 45.72,22.86 v40.64,17.78
SCK_5V
  Top 0.152: LS7366R1.5 19.68,43.81 27.18,36.32 27.18,16.64 27.94,15.88 | Q5.3 33.46,15.96 R11.2 | 32.35,16.38 R11.2 | R11.2 32.68,15.88 27.94,15.88 | LS7366R2.5 27.94,15.88
SCL
  Top 0.152: J4.16 52.07,45.72 53.34,44.45 I2C_3.3V.4
  Bottom 0.152: J1.2 52.07,46.99 J4.16 49.53,44.45 46.99,44.45 J4.11
SCL1
  Bottom 0.152: M1.SCL 19.05,50.55 19.05,49.53 19.68,48.9 42.55,48.9 J4.12
SCL_3.3V  (via drill 0.45)
  Top 0.152: Q2.2 49.21,33.02 | 49.21,33.02 49.21,31.85 R6.2 | v50.8,33.02 49.21,33.02
  Bottom 0.152: J4.15 v50.8,33.02
SCL_5V
  Top 0.152: R5.2 47.99,35.56 Q2.3 50.05,35.29 52.07,33.27 53.32,33.27 I2C_5V.4
SDA
  Top 0.152: J1.1 54.61,44.45 50.8,48.26 49.53,48.26 48.26,46.99 J4.14 | I2C_3.3V.3 51.57,39.87 49.53,41.91 49.53,44.45 J4.14 | J4.9 44.45,44.45 46.99,44.45 J4.14
SDA1  (via drill 0.45)
  Top 0.152: v24.13,47.5 21.34,50.29 M1.SDA
  Bottom 0.152: v24.13,47.5 41.4,47.5 J4.10
SDA_3.3V  (via drill 0.45)
  Top 0.152: Q1.2 49.21,26.77 49.19,26.75 | 49.19,26.75 R8.2 | v45.72,26.67 45.72,25.4 46.1,25.02 48.64,25.02 49.19,25.57 49.19,26.75
  Bottom 0.152: v45.72,26.67 48.26,29.21 J4.13
SDA_5V
  Top 0.152: R7.2 47.99,30.48 Q1.3 50.15,30.21 52.2,32.26 52.2,32.25 I2C_5V.3
SS_ENC1
  Top 0.152: Q3.2 37.75,36.13 R4.2 37.85,38.35 J4.1
SS_ENC1_5V  (via drill 0.45)
  Top 0.152: Q3.3 33.46,36.03 R3.2 | R3.2 32.35,36.45 | R3.2 32.77,37.08 v31.75,38.1 | v22.86,39.37 19.68,42.55 LS7366R1.4
  Bottom 0.152: v31.75,38.1 24.13,38.1 v22.86,39.37
SS_ENC2  (via drill 0.35)
  Top 0.152: Q4.2 37.75,12 | 37.75,12 R10.2 | v40.64,12.7 39.94,12 37.75,12
  Bottom 0.152: J4.3 36.83,41.91 36.83,13.97 38.1,12.7 v40.64,12.7
SS_ENC2_5V
  Top 0.152: Q4.3 33.46,11.9 R9.2 | 32.55,11.68 R9.2 | 32.68,11.81 R9.2 | R9.2 29.76,11.9 27.05,14.61 LS7366R2.4

### Text on the board
tPlace: IDX | SCL | SDA | B | A | SS1 | SS2 | 5V | SDA1 | SCL1 | FLAG1 | FLAG2 | SDA5V | SCL5V | GND | I2C-3.3V | 5V | 1 | I2C-5V | MISO | SCK | MOSI | RST | GND | February, 2020 | IDX | 5V | B | A | 5V | Dual Encoder Shield, RevC | GND | 3.3V